# Altium schematic sheet Base Wiring.SchDoc
size A3; DocumentNumber: 3; SheetNumber: 3; SheetTotal: 5; SheetSize: A3; CheckedByDate: 2022-12-15; DrawByDate: 2022-12-15; SiteName: ESG TD Huangpu
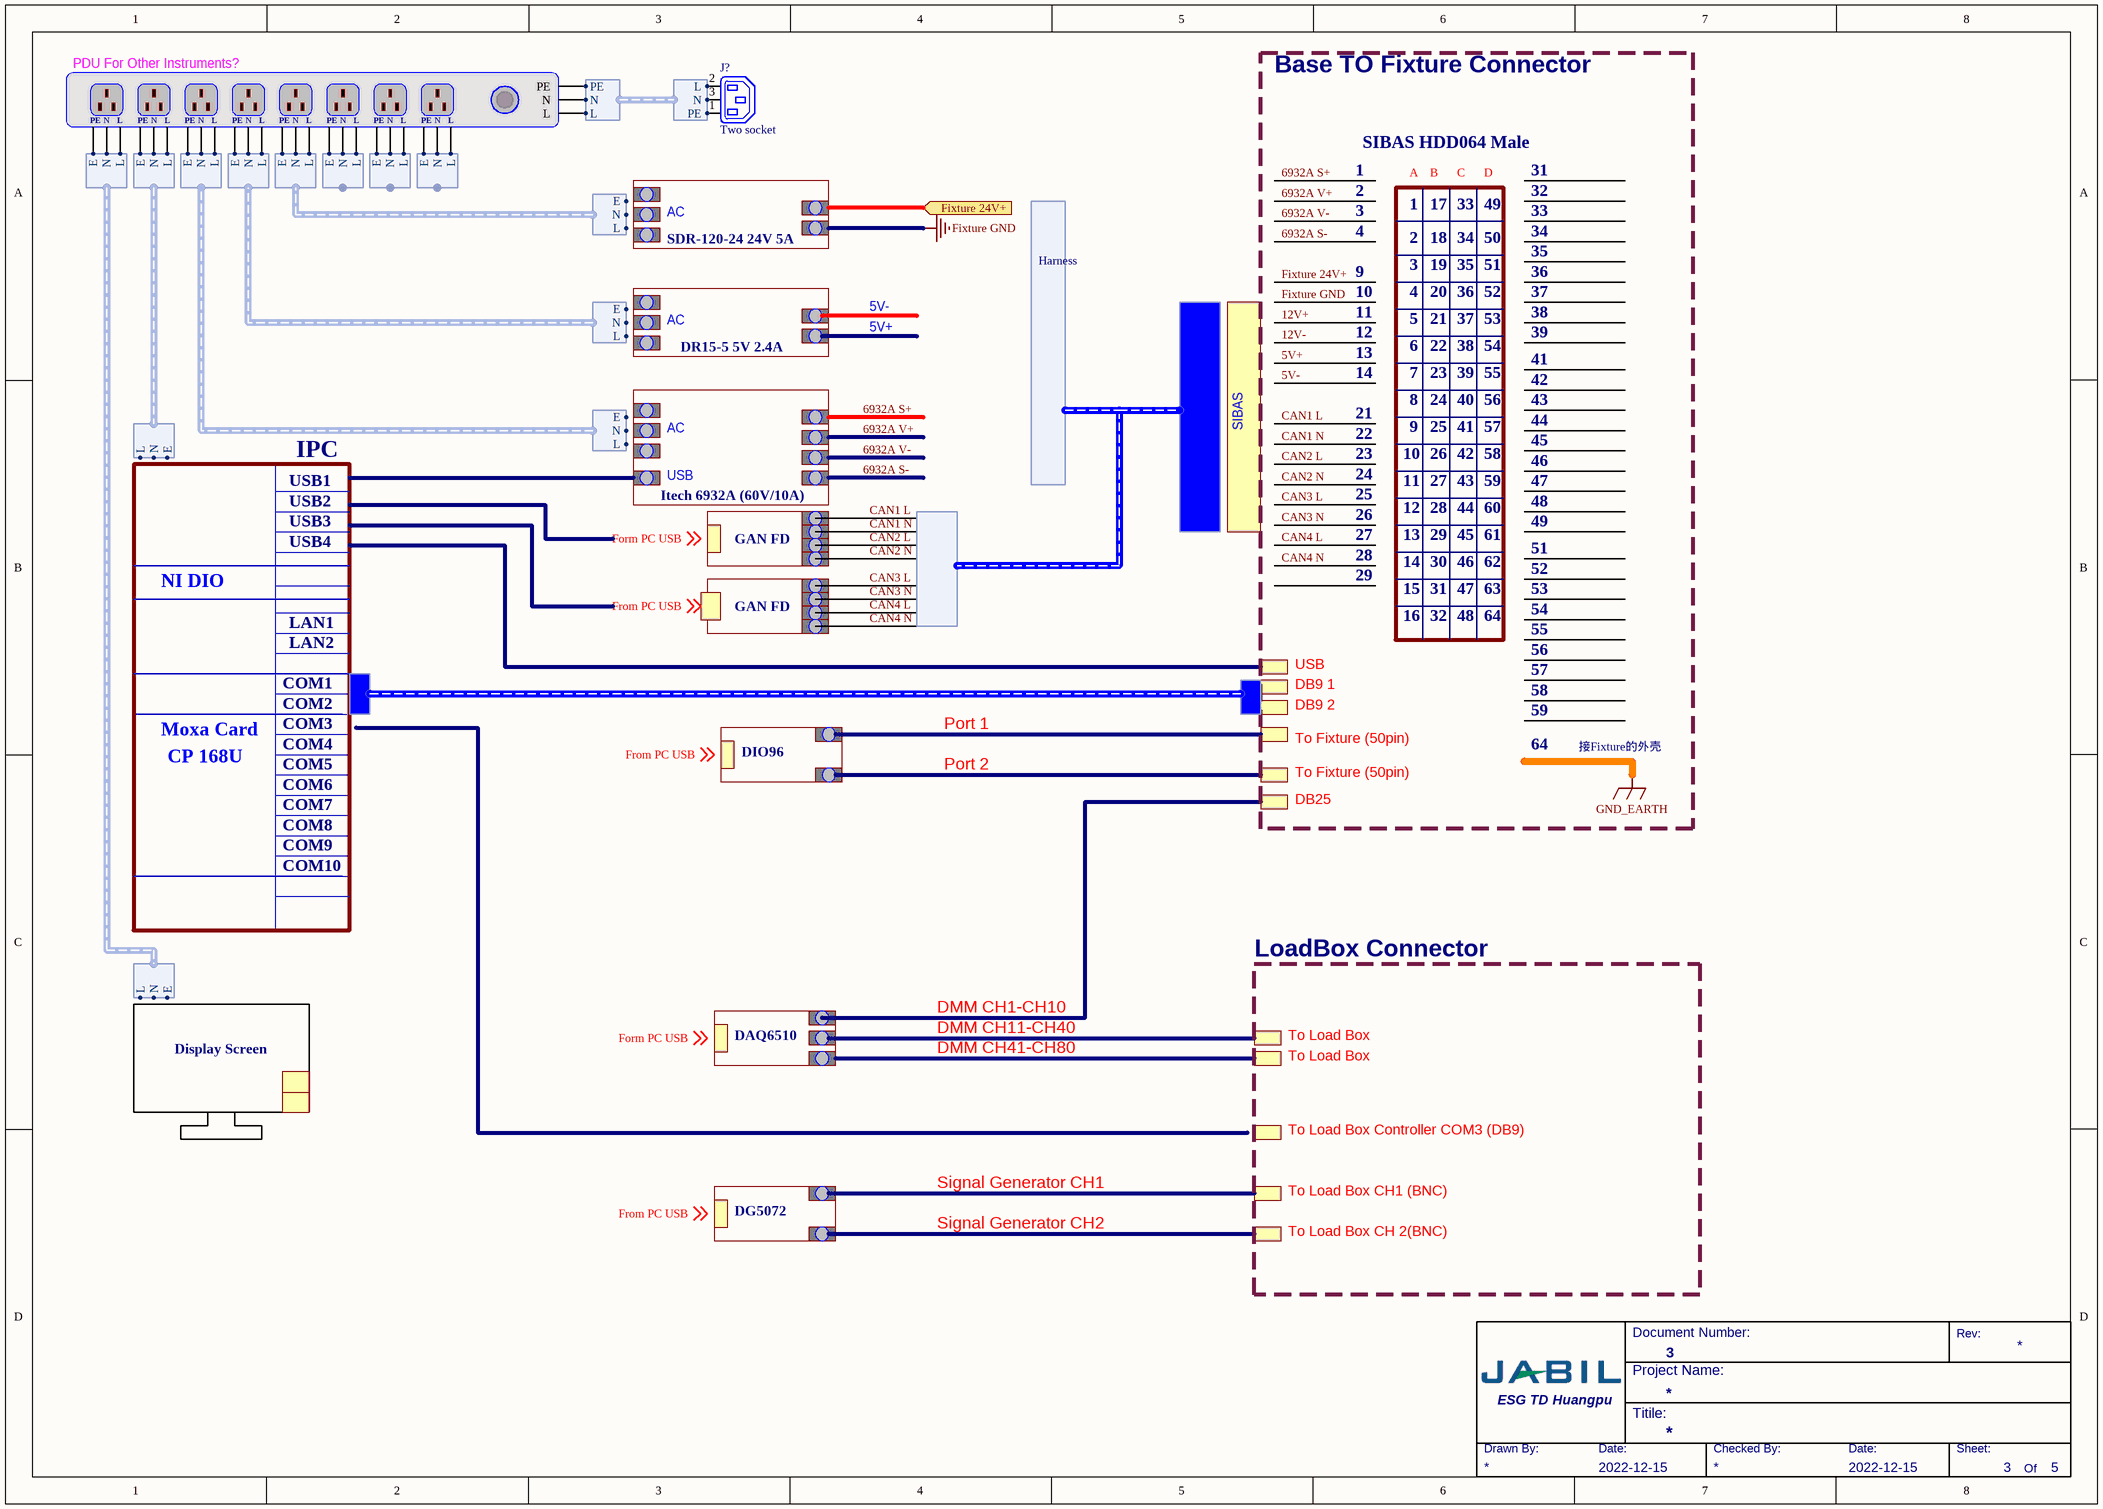
[diagram p0: Base Wiring.SchDoc]

## Parts
J?  Two socket  [IEC7-2H3]
PDU_For_Other_Instruments?  PDU  (value not drawn)

## Ports
Fixture 24V+ (in)

## Harnesses
Power Cord: E, N, L
Power Cord: L, N, PE
Harness: 

## Nets
NetJ?_1: J?.1(L) PDU_For_Other_Instruments?.1(PE) ; harness Power Cord.PE
NetJ?_2: J?.2(N) PDU_For_Other_Instruments?.3(L) ; harness Power Cord.L
NetJ?_3: J?.3(E) PDU_For_Other_Instruments?.2(N) ; harness Power Cord.N
NetPDU_For_Other_Instruments?_4: PDU_For_Other_Instruments?.4(L) ; harness Power Cord.L
NetPDU_For_Other_Instruments?_5: PDU_For_Other_Instruments?.5(N) ; harness Power Cord.N
NetPDU_For_Other_Instruments?_6: PDU_For_Other_Instruments?.6(PE) ; harness Power Cord.E
NetPDU_For_Other_Instruments?_7: PDU_For_Other_Instruments?.7(PE) ; harness Power Cord.L
NetPDU_For_Other_Instruments?_8: PDU_For_Other_Instruments?.8(PE) ; harness Power Cord.N
NetPDU_For_Other_Instruments?_9: PDU_For_Other_Instruments?.9(PE) ; harness Power Cord.E
NetPDU_For_Other_Instruments?_10: PDU_For_Other_Instruments?.10(PE) ; harness Power Cord.L
NetPDU_For_Other_Instruments?_11: PDU_For_Other_Instruments?.11(PE) ; harness Power Cord.N
NetPDU_For_Other_Instruments?_12: PDU_For_Other_Instruments?.12(PE) ; harness Power Cord.E
NetPDU_For_Other_Instruments?_13: PDU_For_Other_Instruments?.13(PE) ; harness Power Cord.L
NetPDU_For_Other_Instruments?_14: PDU_For_Other_Instruments?.14(PE) ; harness Power Cord.N
NetPDU_For_Other_Instruments?_15: PDU_For_Other_Instruments?.15(PE) ; harness Power Cord.E
NetPDU_For_Other_Instruments?_16: PDU_For_Other_Instruments?.16(PE) ; harness Power Cord.L
NetPDU_For_Other_Instruments?_17: PDU_For_Other_Instruments?.17(PE) ; harness Power Cord.N
NetPDU_For_Other_Instruments?_18: PDU_For_Other_Instruments?.18(PE) ; harness Power Cord.E
NetPDU_For_Other_Instruments?_19: PDU_For_Other_Instruments?.19(PE) ; harness Power Cord.L
NetPDU_For_Other_Instruments?_20: PDU_For_Other_Instruments?.20(PE) ; harness Power Cord.N
NetPDU_For_Other_Instruments?_21: PDU_For_Other_Instruments?.21(PE) ; harness Power Cord.E
NetPDU_For_Other_Instruments?_22: PDU_For_Other_Instruments?.22(PE) ; harness Power Cord.L
NetPDU_For_Other_Instruments?_23: PDU_For_Other_Instruments?.23(PE) ; harness Power Cord.N
NetPDU_For_Other_Instruments?_24: PDU_For_Other_Instruments?.24(PE) ; harness Power Cord.E
NetPDU_For_Other_Instruments?_25: PDU_For_Other_Instruments?.25(PE) ; harness Power Cord.L
NetPDU_For_Other_Instruments?_26: PDU_For_Other_Instruments?.26(PE) ; harness Power Cord.N
NetPDU_For_Other_Instruments?_27: PDU_For_Other_Instruments?.27(PE) ; harness Power Cord.E

## Notes on the sheet
- Base TO Fixture Connector
- 1
- SIBAS HDD064 Male
- A
- B
- C
- D
- 31
- AC
- SDR-120-24 24V 5A
- 2
- 3
- 4
- 17
- 18
- 33
- 34
- 49
- 50
- 32
- 5V-
- 9
- 10
- 11
- 19
- 20
- 35
- 36
- 51
- 52
- 38
- 37
- DR15-5 5V 2.4A
- 5V+
- 12
- 14
- 13
- 5
- 6
- 7
- 21
- 22
- 23
- 39
- 53
- 54
- 55
- 41
- SIBAS
- 8
- 24
- 25
- 40
- 56
- 57
- 42
- 43
- 44
- 45
- USB1
- USB2
- IPC
- Itech 6932A (60V/10A)
- USB
- 26
- 27
- 28
- 58
- 59
- 60
- 46
- 48
- 47
- NI DIO
- USB3
- USB4
- GAN FD
- 29
- 30
- 61
- 62
- LAN2
- LAN1
- 15
- 16
- 63
- 64
- COM1
- COM2
- DB9 1
- DB9 2
- Moxa Card
- CP 168U
- COM5
- COM3
- COM4
- DIO96
- Port 1
- Port 2
- To Fixture (50pin)
- 接Fixture的外壳
- COM6
- COM7
- COM8
- COM9
- DB25
- COM10
- LoadBox Connector
- Display Screen
- DAQ6510
- DMM CH1-CH10
- DMM CH41-CH80
- DMM CH11-CH40
- To Load Box
- Signal Generator CH1
- To Load Box Controller COM3 (DB9)
- DG5072
- Signal Generator CH2
- To Load Box CH1 (BNC)
- To Load Box CH 2(BNC)
- Labels drawn without touching a wire or pin: 5V+, 5V-, 12V+, 12V-, 6932A S+, 6932A S-, 6932A V+, 6932A V-, CAN1 L, CAN1 N, CAN2 L, CAN2 N, CAN3 L, CAN3 N, CAN4 L, CAN4 N, Fixture 24V+, Fixture GND, Form PC USB, From PC USB
- Document Number:
- Project Name:
- Rev:
- Drawn By:
- Date:
- Titile:
- Checked By:
- Sheet:
- Of

## Library data of the parts
J? = Plug AC Female: IEC Mains Power Outlet, EN60 320-2-2 F Class I, PC Flange Rear Mount, Chassis Socket; PackageDocument: ver.80, 15-Sep-2003; MaximumRating: 10A, 250V a.c. (UL & CSA 15A, 250V a.c.); MountingFixtures: Not drawn on schematic symbol.; PCB_Layout: Complies with manufacturer's recommendation.; DrillSize: Corresponds to nominal value.; Published: 15-Jul-2004; LatestRevisionDate: 15-Jul-2004; LatestRevisionNote: Component Replaced & renamed from "Phonejack".; DatasheetDocument: ver.80, 15-Sep-2003; PackageReference: PX0675/PC; Publisher: Altium Limited; Terminations: P.C. Spills; ComponentLink1Description: Manufacturer Link; ComponentLink1URL: http://www.bulgin.co.uk/